# Altium project real_watch_1v1.PrjPcb
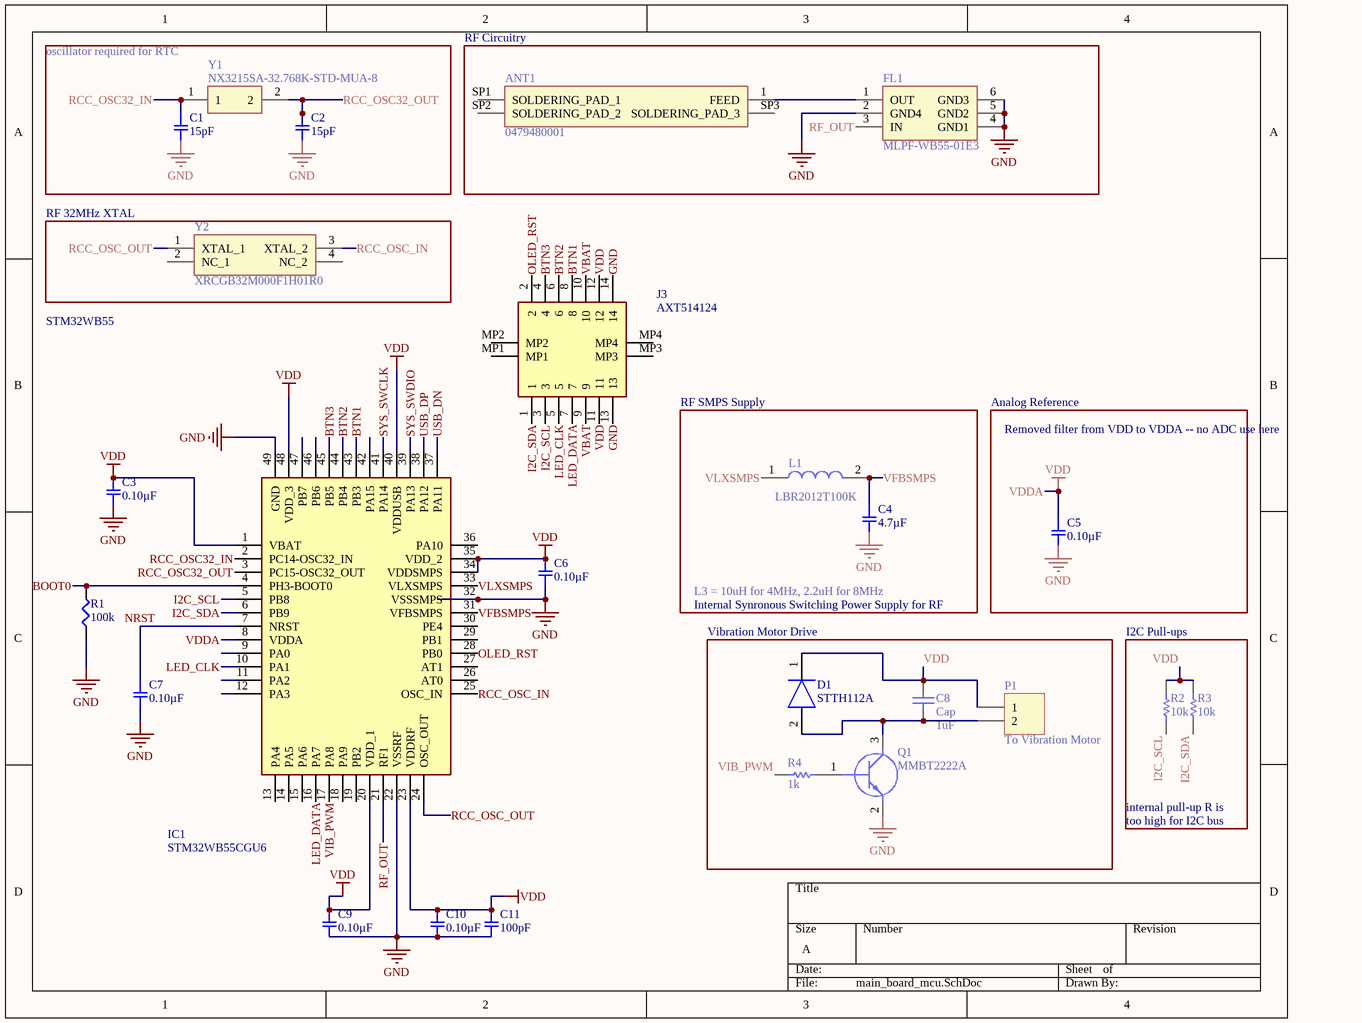
[diagram p0: main_board_mcu.SchDoc]
2 sheets, 41 parts. Net scope: global (net labels, ports and power ports of the same name join across sheets).
Board file: real_watch_1v1_main.PcbDoc
Sheets:
  main_board_mcu.SchDoc
  main_board_power.SchDoc

## Sheet main_board_mcu.SchDoc
size A

### Parts
ANT1  0479480001  [0479480001]
C1  15pF  [0402C]
C2  15pF  [0402C]
C3  0.10µF  [0402C]
C4  4.7µF  [0402C]
C5  0.10µF  [0402C]
C6  0.10µF  [0402C]
C7  0.10µF  [0402C]
C8  Cap  value 1uF  [0402C]
C9  0.10µF  [0402C]
C10  0.10µF  [0402C]
C11  100pF  [0402C]
D1  STTH112A  [DIOM5126X265N]
FL1  MLPF-WB55-01E3  [MLPFWB5501E3]
IC1  STM32WB55CGU6  [QFN50P700X700X65-49N-D]
J3  AXT514124  [AXT514124]
L1  LBR2012T100K  [INDC2012X145N]
P1  To Vibration Motor  [HDR1X2]
Q1  MMBT2222A  [SOT95P240X120-3N]
R1  100k  [0402R]
R2  10k  [0402R]
R3  10k  [0402R]
R4  1k  [0402R]
Y1  NX3215SA-32.768K-STD-MUA-8  [NX3215SA]
Y2  XRCGB32M000F1H01R0  [XRCGB32M000F1H01R0]

### Blocks framed on the sheet
oscillator required for RTC: C1 C2 Y1
RF Circuitry: ANT1 FL1
RF 32MHz XTAL: Y2
Vibration Motor Drive: C8 D1 P1 Q1 R4

### Nets
GND: C1.2 C2.2 C3.2 C4.2 C5.2 C6.2 C7.2 C9.2 C10.2 C11.2 FL1.2(GND4) FL1.4(GND1) FL1.5(GND2) FL1.6(GND3) IC1.22(VSSRF) IC1.32(VSSSMPS) IC1.49(GND) J3.13 J3.14 Q1.2(E) R1.1
VDD: C3.1 C5.1 C6.1 C8.2 C9.1 C10.1 C11.1 D1.1(K) IC1.1(VBAT) IC1.8(VDDA) IC1.20(VDD_1) IC1.23(VDDRF) IC1.34(VDDSMPS) IC1.35(VDD_2) IC1.40(VDDUSB) IC1.48(VDD_3) J3.11 J3.12 P1.1 R2.1 R3.1  [also labelled VDDA]
BOOT0: IC1.4(PH3-BOOT0) R1.2
BTN1: IC1.43(PB3) J3.8
BTN2: IC1.44(PB4) J3.6
BTN3: IC1.45(PB5) J3.4
I2C_SCL: IC1.5(PB8) J3.3 R2.2
I2C_SDA: IC1.6(PB9) J3.1 R3.2
LED_CLK: IC1.10(PA1) J3.5
LED_DATA: IC1.16(PA7) J3.7
NRST: C7.1 IC1.7(NRST)
OLED_RST: IC1.28(PB0) J3.2
RCC_OSC32_IN: C1.1 IC1.2(PC14-OSC32_IN) Y1.1
RCC_OSC32_OUT: C2.1 IC1.3(PC15-OSC32_OUT) Y1.2
RCC_OSC_IN: IC1.25(OSC_IN) Y2.3(XTAL_2)
RCC_OSC_OUT: IC1.24(OSC_OUT) Y2.1(XTAL_1)
RF_OUT: FL1.3(IN) IC1.21(RF1)
SYS_SWCLK: IC1.41(PA14)
SYS_SWDIO: IC1.39(PA13)
USB_DN: IC1.37(PA11)
USB_DP: IC1.38(PA12)
VBAT: J3.9 J3.10
VFBSMPS: C4.1 IC1.31(VFBSMPS) L1.2
VIB_PWM: IC1.17(PA8) R4.2
VLXSMPS: IC1.33(VLXSMPS) L1.1
NetANT1_1: ANT1.1(FEED) FL1.1(OUT)
NetC8_1: C8.1 D1.2(A) P1.2 Q1.3(C)
NetQ1_1: Q1.1(B) R4.1

Not connected (* = marked no-connect by the designer): ANT1 SP1(SOLDERING_PAD_1) SP2(SOLDERING_PAD_2) SP3(SOLDERING_PAD_3); IC1 9(PA0) 11(PA2) 12(PA3) 13(PA4) 14(PA5) 15(PA6) 18(PA9) 19(PB2) 26(AT0) 27(AT1) 29(PB1) 30(PE4) 36(PA10) 42(PA15) 46(PB6) 47(PB7); J3 MP1 MP2 MP3 MP4; Y2 2(NC_1) 4(NC_2)

### Notes on the sheet
- STM32WB55
- RF SMPS Supply
- Analog Reference
- Removed filter from VDD to VDDA -- no ADC use here
- L3 = 10uH for 4MHz, 2.2uH for 8MHz
- Internal Synronous Switching Power Supply for RF
- I2C Pull-ups
- internal pull-up R is
- too high for I2C bus

### Library data of the parts
ANT1 = 0479480001: Antenna; Manufacturer_Name: Molex; Datasheet Link: https://www.molex.com/pdm_docs/sd/479480001_sd.pdf; Height: 4mm; Manufacturer_Part_Number: 0479480001
C1 C2 = GCM1555C1H150JA16D: CAP CER 15PF 50V NP0 0402; Manufacturer: Murata Electronics North America; Factory Stock: 0; Unit Price (USD): 0.1; Minimum Quantity: 1; Tolerance: ±5%; Temperature Coefficient: C0G, NP0; Datasheets: http://www.murata.com/~/media/webrenewal/support/library/catalog/products/capacitor/mlcc/c03e.ashx; Image: //media.digikey.com/Renders/Murata%20Renders/ZRB-SERIES-0402.jpg; Digi-Key Part Number: 490-11147-1-ND; Part Number: GCM1555C1H150JA16D; Quantity Available: 6185; @ qty: 0; Packaging: Cut Tape (CT); Series: GCM; Part Status: Active; Value: 15pF; Voltage: 50V; Operating Temperature: -55°C ~ 125°C; Features: -; Ratings: AEC-Q200; Applications: Automotive; Mounting Type: Surface Mount, MLCC; Package / Case: 0402 (1005 Metric); Size / Dimension: 0.039" L x 0.020" W (1.00mm x 0.50mm); Height - Seated (Max): -; Thickness (Max): 0.022" (0.55mm); Lead Spacing: -; Lead Style: -
C3 C5-C7 C9 C10 = GCM155R71C104KA55D: CAP CER 0.1UF 16V X7R 0402; Manufacturer: Murata Electronics North America; Factory Stock: 0; Unit Price (USD): 0.1; Minimum Quantity: 1; Tolerance: ±10%; Datasheets: http://www.murata.com/~/media/webrenewal/support/library/catalog/products/capacitor/mlcc/c03e.ashx; Image: //media.digikey.com/Renders/Murata%20Renders/ZRB-SERIES-0402.jpg; Digi-Key Part Number: 490-4759-1-ND; Part Number: GCM155R71C104KA55D; Quantity Available: 734194; @ qty: 0; Packaging: Cut Tape (CT); Series: GCM; Part Status: Active; Value: 0.10µF; Voltage: 16V; Temperature Coefficient: X7R; Operating Temperature: -55°C ~ 125°C; Features: -; Ratings: AEC-Q200; Applications: Automotive; Mounting Type: Surface Mount, MLCC; Package / Case: 0402 (1005 Metric); Size / Dimension: 0.039" L x 0.020" W (1.00mm x 0.50mm); Height - Seated (Max): -; Thickness (Max): 0.022" (0.55mm); Lead Spacing: -; Lead Style: -
C4 = GRM153R60G475ME15D: CAP CER 4.7UF 4V X5R 0402; Manufacturer: Murata Electronics North America; Factory Stock: 0; Unit Price (USD): 0.27; Minimum Quantity: 1; Tolerance: ±20%; Datasheets: http://psearch.en.murata.com/capacitor/product/GRM153R60G475ME15%23.pdf; Image: //media.digikey.com/Renders/Murata%20Renders/ZRB-SERIES-0402.jpg; Digi-Key Part Number: 490-13231-1-ND; Part Number: GRM153R60G475ME15D; Quantity Available: 9100; @ qty: 0; Packaging: Cut Tape (CT); Series: GRM; Part Status: Active; Value: 4.7µF; Voltage: 4V; Temperature Coefficient: X5R; Operating Temperature: -55°C ~ 85°C; Features: -; Ratings: -; Applications: General Purpose; Mounting Type: Surface Mount, MLCC; Package / Case: 0402 (1005 Metric); Size / Dimension: 0.039" L x 0.020" W (1.00mm x 0.50mm); Height - Seated (Max): -; Thickness (Max): 0.013" (0.33mm); Lead Spacing: -; Lead Style: -
C8 = Cap: Capacitor; Published: 8-Jun-2000; LatestRevisionDate: 17-Jul-2002; LatestRevisionNote: Re-released for DXP Platform.; PackageReference: RAD-0.3; Publisher: Altium Limited; PackageDescription: Radial Cap, Thru-Hole; 2 Leads; 0.3 in Pin Spacing
C11 = GCM1555C1H101JA16D: CAP CER 100PF 50V NP0 0402; Manufacturer: Murata Electronics North America; Factory Stock: 0; Unit Price (USD): 0.1; Minimum Quantity: 1; Tolerance: ±5%; Temperature Coefficient: C0G, NP0; Datasheets: http://www.murata.com/~/media/webrenewal/support/library/catalog/products/capacitor/mlcc/c03e.ashx; Image: //media.digikey.com/Renders/Murata%20Renders/ZRB-SERIES-0402.jpg; Digi-Key Part Number: 490-10669-1-ND; Part Number: GCM1555C1H101JA16D; Quantity Available: 61397; @ qty: 0; Packaging: Cut Tape (CT); Series: GCM; Part Status: Active; Value: 100pF; Voltage: 50V; Operating Temperature: -55°C ~ 125°C; Features: -; Ratings: AEC-Q200; Applications: Automotive; Mounting Type: Surface Mount, MLCC; Package / Case: 0402 (1005 Metric); Size / Dimension: 0.039" L x 0.020" W (1.00mm x 0.50mm); Height - Seated (Max): -; Thickness (Max): 0.022" (0.55mm); Lead Spacing: -; Lead Style: -
D1 = STTH112A: Diode; Manufacturer_Name: STMicroelectronics; Allied_Number: 70391556; Datasheet Link: http://www.st.com/web/en/resource/technical/document/datasheet/CD00003260.pdf; Height: 2.65mm; Manufacturer_Part_Number: STTH112A; Mouser Part Number: 511-STTH112A; Mouser Price/Stock: https://www.mouser.com/Search/Refine.aspx?Keyword=511-STTH112A; RS Part Number: 0249319; RS Price/Stock: http://uk.rs-online.com/web/p/products/0249319; Allied Price/Stock: http://www.alliedelec.com/stmicroelectronics-stth112a/70391556/
FL1 = MLPF-WB55-01E3: Filter; Manufacturer_Name: STMicroelectronics; Datasheet Link: https://www.st.com/resource/en/datasheet/mlpf-wb55-01e3.pdf; Height: 0.7mm; Manufacturer_Part_Number: MLPF-WB55-01E3; Mouser Part Number: 511-MLPF-WB55-01E3; Mouser Price/Stock: https://www.mouser.com/Search/Refine.aspx?Keyword=511-MLPF-WB55-01E3; RS Part Number: 1924203; RS Price/Stock: http://uk.rs-online.com/web/p/products/1924203
IC1 = STM32WB55CGU6: Integrated Circuit; Manufacturer_Name: STMicroelectronics; Datasheet Link: https://www.st.com/en/microcontrollers/stm32wb55cg.html; Height: 0.65mm; Manufacturer_Part_Number: STM32WB55CGU6; Mouser Part Number: 511-STM32WB55CGU6; Mouser Price/Stock: https://www.mouser.com/Search/Refine.aspx?Keyword=511-STM32WB55CGU6
J3 = AXT514124: Connector; Manufacturer_Name: Panasonic; Datasheet Link: https://componentsearchengine.com/Datasheets/1/AXT514124.pdf; Height: 1.17mm; Manufacturer_Part_Number: AXT514124; Mouser Part Number: 769-AXT514124; Mouser Price/Stock: https://www.mouser.com/Search/Refine.aspx?Keyword=769-AXT514124
L1 = LBR2012T100K: Inductor; Manufacturer_Name: TAIYO YUDEN; Datasheet Link: https://componentsearchengine.com/Datasheets/2/LBR2012T100K.pdf; Height: 1.45mm; Manufacturer_Part_Number: LBR2012T100K; Mouser Part Number: 963-LBR2012T100K; Mouser Price/Stock: https://www.mouser.com/Search/Refine.aspx?Keyword=963-LBR2012T100K
P1 = Header 2: Header, 2-Pin; LatestRevisionDate: 17-Jul-2002; LatestRevisionNote: Re-released for DXP Platform.; Publisher: Altium Limited
Q1 = MMBT2222A: Transistor BJT NPN; Manufacturer_Name: ON Semiconductor; Datasheet Link: https://www.onsemi.com/pub/Collateral/PZT2222A-D.pdf; Height: 1.2mm; Manufacturer_Part_Number: MMBT2222A; Mouser Part Number: 512-MMBT2222A; Mouser Price/Stock: https://www.mouser.com/Search/Refine.aspx?Keyword=512-MMBT2222A; RS Part Number: 7390350P; RS Price/Stock: http://uk.rs-online.com/web/p/products/7390350P
R1 = ERJ-2RKF1003X: RES SMD 100K OHM 1% 1/10W 0402; Manufacturer: Panasonic Electronic Components; Factory Stock: 0; Unit Price (USD): 0.00496; @ qty: 1500; Minimum Quantity: 1; Power (Watts): 0.1W, 1/10W; Temperature Coefficient: ±100ppm/°C; Part Number: ERJ-2RKF1003X; Datasheets: http://industrial.panasonic.com/www-cgi/jvcr13pz.cgi?E+PZ+3+AOA0002+ERJ2RKF1003X+7+WW; Image: //media.digikey.com/Photos/Panasonic%20Photos/ERJ-PA2-Series.jpg; Digi-Key Part Number: P100KLCT-ND; Quantity Available: 2645965; Packaging: Cut Tape (CT); Series: ERJ; Part Status: Active; Value: 100k; Tolerance: ±1%; Composition: Thick Film; Features: Automotive AEC-Q200; Operating Temperature: -55°C ~ 155°C; Package / Case: 0402 (1005 Metric); Supplier Device Package: 0402; Size / Dimension: 0.039" L x 0.020" W (1.00mm x 0.50mm); Height - Seated (Max): 0.016" (0.40mm); Number of Terminations: 2; Failure Rate: -
R2-R4 = Resistor
Y1 = NX3215SA-32.768K-STD-MUA-8: Crystal or Oscillator; Manufacturer_Name: NDK; Datasheet Link: http://www.ndk.com/images/products/catalog/c_NX3215SA-STD-MUA-14_e.pdf; Manufacturer_Part_Number: NX3215SA-32.768K-STD-MUA-8; Mouser Part Number: 344-NX3215SA32768K8; Mouser Price/Stock: https://www.mouser.com/Search/Refine.aspx?Keyword=344-NX3215SA32768K8
Y2 = XRCGB32M000F1H01R0: Crystal or Oscillator; Manufacturer_Name: Murata Electronics; Datasheet Link: https://www.murata.com/en-eu/products/productdetail?partno=XRCGB32M000F1H01R0; Height: 0.7mm; Manufacturer_Part_Number: XRCGB32M000F1H01R0; Mouser Part Number: 81-XRCGB32M000F1H01R; Mouser Price/Stock: https://www.mouser.com/Search/Refine.aspx?Keyword=81-XRCGB32M000F1H01R

## Sheet main_board_power.SchDoc
size A
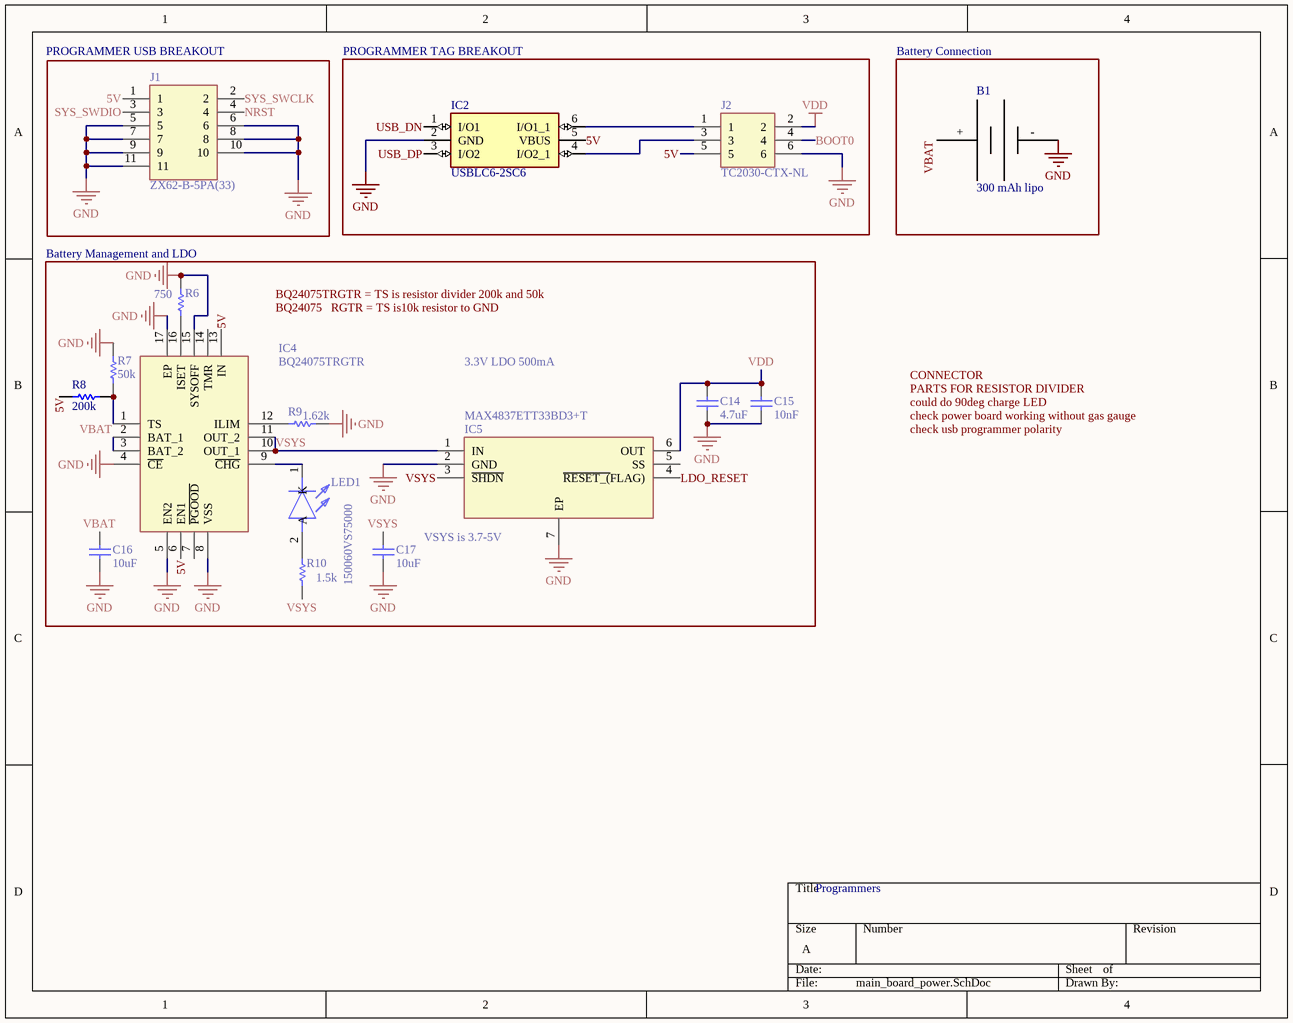
[diagram p1: main_board_power.SchDoc]

### Parts
B1  300 mAh lipo  [RJD3048ST1]
C14  value 4.7uF  [0402C]  (hidden comment: Cap)
C15  value 10nF  [0402C]  (hidden comment: Cap)
C16  value 10uF  [0402C]  (hidden comment: Cap)
C17  value 10uF  [0402C]  (hidden comment: Cap)
IC2  USBLC6-2SC6  [SOT95P280X145-6N]
IC4  BQ24075TRGTR  [QFN50P300X300X100-17N-D]
IC5  MAX4837ETT33BD3+T  [SON95P300X300X80-7N]
J1  ZX62-B-5PA(33)  [ZX62B5PA33]
J2  TC2030-CTX-NL  [TC2030MCPNL10]
LED1  150060VS75000  [LEDC1608X80N]
R6  750  [0402R]
R7  50k  [0402R]
R8  200k  [0402R]
R9  1.62k  [0402R]
R10  1.5k  [0402R]

### Blocks framed on the sheet
PROGRAMMER USB BREAKOUT: J1
PROGRAMMER TAG BREAKOUT: IC2 J2
Battery Connection: B1

### Nets
GND: B1.- C14.2 C15.2 C16.2 C17.2 IC2.2(GND) IC4.4(~{CE}) IC4.5(EN2) IC4.8(VSS) IC4.15(SYSOFF) IC4.17(EP) IC5.2(GND) IC5.7(EP) J1.5 J1.6 J1.7 J1.8 J1.9 J1.10 J1.11 J2.6 R6.1 R7.1 R9.2
VDD: C14.1 C15.1 IC5.6(OUT) J2.2
5V: IC2.5(VBUS) IC4.6(EN1) IC4.13(IN) J1.1 J2.5 R8.1
BOOT0: J2.4
LDO_RESET: IC5.4(~{RESET_(}FLAG))
NRST: J1.4
SYS_SWCLK: J1.2
SYS_SWDIO: J1.3
USB_DN: IC2.1(I/O1)
USB_DP: IC2.3(I/O2)
VBAT: B1.+ C16.1 IC4.2(BAT_1) IC4.3(BAT_2)
VSYS: C17.1 IC4.10(OUT_1) IC4.11(OUT_2) IC5.1(IN) IC5.3(~{SHDN}) R10.2
NetIC2_4: IC2.4(I/O2_1) J2.3
NetIC2_6: IC2.6(I/O1_1) J2.1
NetIC4_1: IC4.1(TS) R7.2 R8.2
NetIC4_9: IC4.9(~{CHG}) LED1.1(K)
NetIC4_12: IC4.12(ILIM) R9.1
NetIC4_16: IC4.16(ISET) R6.2
NetLED1_2: LED1.2(A) R10.1

Not connected (* = marked no-connect by the designer): IC4 7(~{PGOOD}) 14(TMR); IC5 5(SS)

### Notes on the sheet
- (near R6) Battery Management and LDO
- 3.3V LDO 500mA
- (near IC5) VSYS is 3.7-5V
- Programmers
- Labels drawn without touching a wire or pin: BQ24075   RGTR = TS is10k resistor to GND, BQ24075TRGTR = TS is resistor divider 200k and 50k, check power board working without gas gauge, check usb programmer polarity, CONNECTOR, could do 90deg charge LED, PARTS FOR RESISTOR DIVIDER

### Library data of the parts
B1 = RJD3048ST1: Illinois Capacitor 300mAh Lipo Battery; pin to pad: +>Pos ->Neg
C14-C17 = Cap: Capacitor; Published: 8-Jun-2000; LatestRevisionDate: 17-Jul-2002; LatestRevisionNote: Re-released for DXP Platform.; PackageReference: RAD-0.3; Publisher: Altium Limited; PackageDescription: Radial Cap, Thru-Hole; 2 Leads; 0.3 in Pin Spacing
IC2 = USBLC6-2SC6: Integrated Circuit; Manufacturer_Name: STMicroelectronics; Allied_Number: 70389689; Datasheet Link: http://www.st.com/st-web-ui/static/active/en/resource/technical/document/datasheet/CD00050750.pdf; Height: 1.45mm; Manufacturer_Part_Number: USBLC6-2SC6; Mouser Part Number: 511-USBLC6-2SC6; Mouser Price/Stock: https://www.mouser.com/Search/Refine.aspx?Keyword=511-USBLC6-2SC6; RS Part Number: 9206266; RS Price/Stock: https://uk.rs-online.com/web/p/products/9206266; Allied Price/Stock: http://www.alliedelec.com/stmicroelectronics-usblc6-2sc6/70389689/
IC4 = BQ24075TRGTR: Integrated Circuit; Manufacturer_Name: Texas Instruments; Datasheet Link: http://componentsearchengine.com/Datasheets/1/BQ24075TRGTR.pdf; Height: 1mm; Manufacturer_Part_Number: BQ24075TRGTR; Mouser Part Number: 595-BQ24075TRGTR; Mouser Price/Stock: https://www.mouser.com/Search/Refine.aspx?Keyword=595-BQ24075TRGTR
IC5 = MAX4837ETT33BD3+T: Integrated Circuit; Manufacturer_Name: Maxim Integrated; Datasheet Link: https://datasheets.maximintegrated.com/en/ds/MAX4836-MAX4837.pdf; Height: 0.8mm; Manufacturer_Part_Number: MAX4837ETT33BD3+T
J1 = ZX62-B-5PA(33): Connector; Manufacturer_Name: Hirose; Datasheet Link: http://www.mouser.com/ds/2/185/ZX_catalog-939768.pdf; Height: 2.8mm; Manufacturer_Part_Number: ZX62-B-5PA(33); Mouser Part Number: 798-ZX62-B-5PA33; Mouser Price/Stock: https://www.mouser.com/Search/Refine.aspx?Keyword=798-ZX62-B-5PA33; RS Part Number: 1362267; RS Price/Stock: http://uk.rs-online.com/web/p/products/1362267
J2 = TC2030-CTX-NL: Connector; Manufacturer_Name: Tag Connect; Datasheet Link: http://www.tag-connect.com/Materials/TC2030-CTX.pdf; Height: 18mm; Manufacturer_Part_Number: TC2030-CTX-NL
LED1 = 150060VS75000: LED; Manufacturer_Name: Wurth Elektronik; Datasheet Link: http://docs-emea.rs-online.com/webdocs/1302/0900766b81302e1e.pdf; Height: 0.8mm; Manufacturer_Part_Number: 150060VS75000; Mouser Part Number: 710-150060VS75000; Mouser Price/Stock: https://www.mouser.com/Search/Refine.aspx?Keyword=710-150060VS75000; RS Part Number: 8154215P; RS Price/Stock: http://uk.rs-online.com/web/p/products/8154215P
R6-R10 = Resistor

## Nets that join several sheets
GND: main_board_mcu (21 pins), main_board_power (24 pins)
VDD: main_board_mcu (21 pins), main_board_power (C14.1 C15.1 IC5.6 J2.2)
BOOT0: main_board_mcu (IC1.4 R1.2), main_board_power (J2.4)
NRST: main_board_mcu (C7.1 IC1.7), main_board_power (J1.4)
SYS_SWCLK: main_board_mcu (IC1.41), main_board_power (J1.2)
SYS_SWDIO: main_board_mcu (IC1.39), main_board_power (J1.3)
USB_DN: main_board_mcu (IC1.37), main_board_power (IC2.1)
USB_DP: main_board_mcu (IC1.38), main_board_power (IC2.3)
VBAT: main_board_mcu (J3.9 J3.10), main_board_power (B1.+ C16.1 IC4.2 IC4.3)